# Altium project coreboardV0.1.PrjPCB
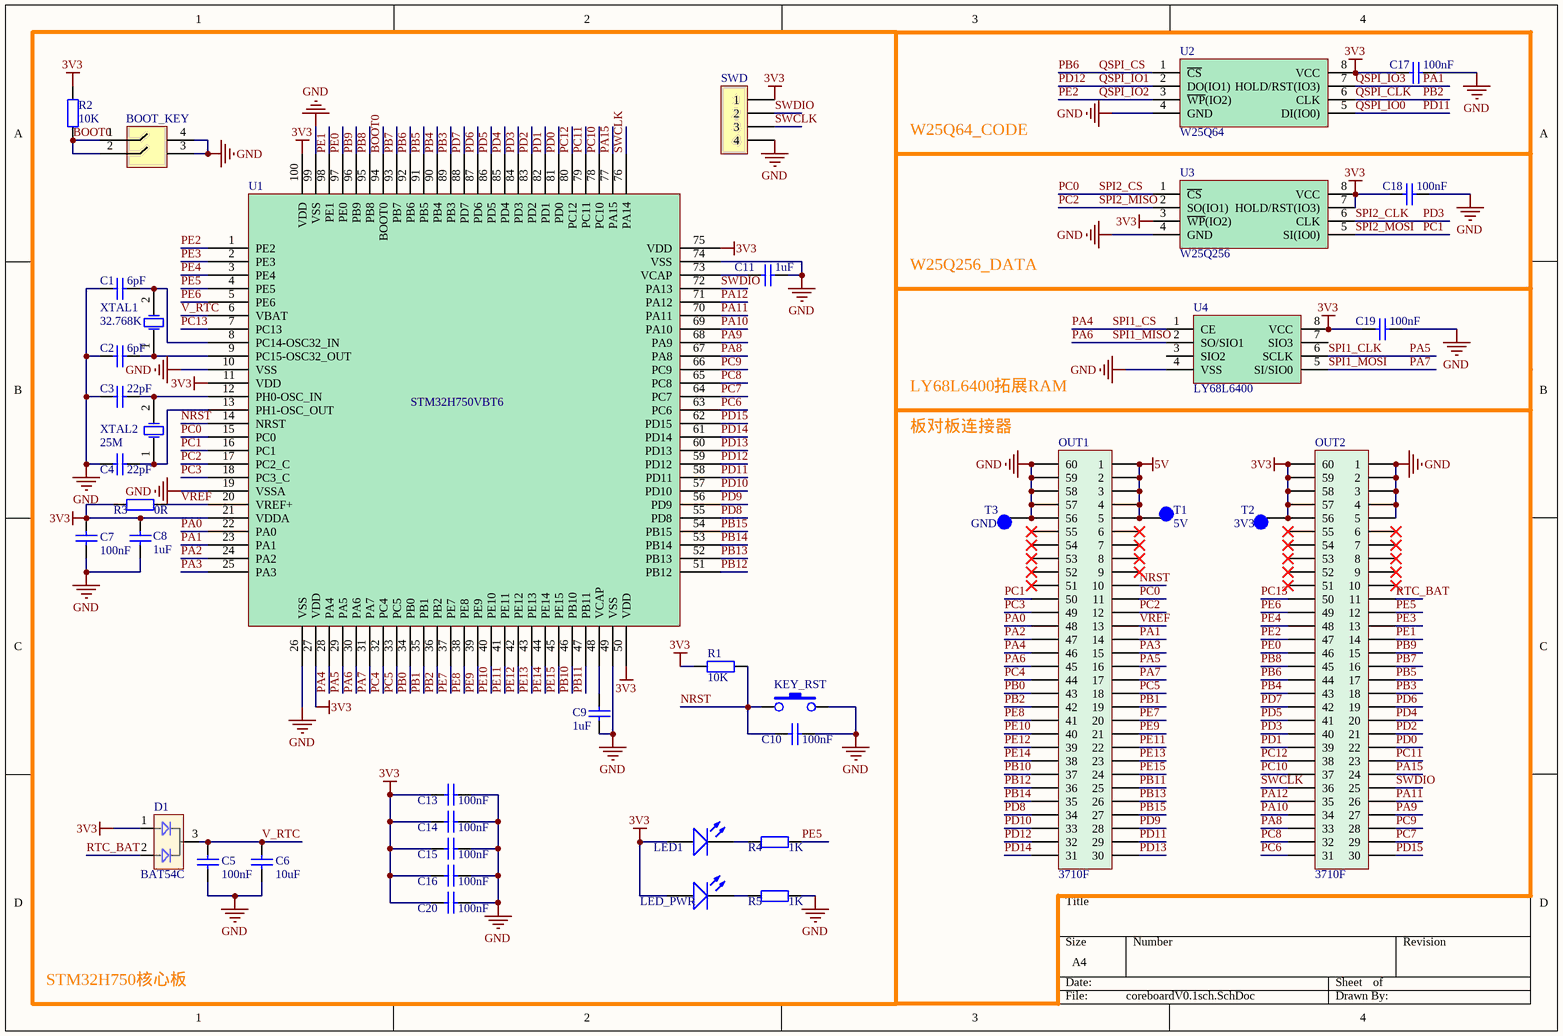
[diagram p0: coreboardV0.1sch.SchDoc]
1 sheet, 41 parts. Net scope: global (net labels, ports and power ports of the same name join across sheets).
Board file: coreboardV0.1pcb.PcbDoc

## Sheet coreboardV0.1sch.SchDoc
size A4

### Parts
BOOT_KEY  KE_2  [KE_2_1.27]  (value not drawn)
C1  6pF  [0603_C]
C2  6pF  [0603_C]
C3  22pF  [0603_C]
C4  22pF  [0603_C]
C5  100nF  [0603_C]
C6  10uF  [0603_C]
C7  100nF  [0603_C]
C8  1uF  [0603_C]
C9  1uF  [0603_C]
C10  100nF  [0603_C]
C11  1uF  [0603_C]
C13  100nF  [0603_C]
C14  100nF  [0603_C]
C15  100nF  [0603_C]
C16  100nF  [0603_C]
C17  100nF  [0603_C]
C18  100nF  [0603_C]
C19  100nF  [0603_C]
C20  100nF  [0603_C]
D1  BAT54C  [BAT54C]
KEY_RST  KEY_SMT  [KEY_SMT]  (value not drawn)
LED1  0805_LED  [0805_LED]  (value not drawn)
LED_PWR  0805_LED  [0805_LED]  (value not drawn)
OUT1  3710F  [3710F060046G3FT01]
OUT2  3710F  [3710F060046G3FT01]
R1  10K  [0603_R]
R2  10K  [0603_R]
R3  0R  [0603_R]
R4  1K  [0603_R]
R5  1K  [0603_R]
SWD  Header_2.54_4P  [HDR1_4P]  (value not drawn)
T1  5V  [TEST_POINT_2mm]
T2  3V3  [TEST_POINT_2mm]
T3  GND  [TEST_POINT_2mm]
U1  STM32H750VBT6  [LQFP100]  (value not drawn)
U2  W25Q64  [SOIC8-208MIL]
U3  W25Q256  [WSON8]
U4  LY68L6400  [SOP8-150MIL]
XTAL1  32.768K  [XTAL_32.768_3215_2]
XTAL2  25M  [XTAL_5032_2]

### Blocks framed on the sheet
STM32H750核心板: BOOT_KEY C1-C11 C13-C16 C20 D1 KEY_RST LED1 LED_PWR R1-R5 SWD U1 XTAL1 XTAL2

### Nets
3V3: C7.2 C8.1 C13.2 C14.2 C15.2 C16.2 C17.1 C18.1 C19.1 C20.2 D1.1 LED1.A LED_PWR.A OUT2.56 OUT2.57 OUT2.58 OUT2.59 OUT2.60 R1.2 R2.1 R3.1 SWD.1 T2.1 U1.11(VDD) U1.21(VDDA) U1.27(VDD) U1.50(VDD) U1.75(VDD) U1.100(VDD) U2.8(VCC) U3.3(~{WP}(IO2)) U3.7(HOLD/RST(IO3)) U3.8(VCC) U4.8(VCC)
5V: OUT1.1 OUT1.2 OUT1.3 OUT1.4 OUT1.5 T1.1
GND: BOOT_KEY.3 BOOT_KEY.4 C1.1 C2.1 C3.1 C4.1 C5.1 C6.1 C7.1 C8.2 C9.2 C10.1 C11.2 C13.1 C14.1 C15.1 C16.1 C17.2 C18.2 C19.2 C20.1 KEY_RST.2 OUT1.56 OUT1.57 OUT1.58 OUT1.59 OUT1.60 OUT2.1 OUT2.2 OUT2.3 OUT2.4 OUT2.5 R5.2 SWD.4 T3.1 U1.10(VSS) U1.19(VSSA) U1.26(VSS) U1.49(VSS) U1.74(VSS) U1.99(VSS) U2.4(GND) U3.4(GND) U4.4(VSS)
BOOT0: BOOT_KEY.1 BOOT_KEY.2 R2.2 U1.94(BOOT0)
NRST: C10.2 KEY_RST.1 OUT1.10 R1.1 U1.14(NRST)
PA0: OUT1.48 U1.22(PA0)
PA1: OUT1.14 U1.23(PA1) U2.7(HOLD/RST(IO3))  [also labelled QSPI_IO3]
PA2: OUT1.47 U1.24(PA2)
PA3: OUT1.15 U1.25(PA3)
PA4: OUT1.46 U1.28(PA4) U4.1(CE)  [also labelled SPI1_CS]
PA5: OUT1.16 U1.29(PA5) U4.6(SCLK)  [also labelled SPI1_CLK]
PA6: OUT1.45 U1.30(PA6) U4.2(SO/SIO1)  [also labelled SPI1_MISO]
PA7: OUT1.17 U1.31(PA7) U4.5(SI/SIO0)  [also labelled SPI1_MOSI]
PA8: OUT2.33 U1.67(PA8)
PA9: OUT2.27 U1.68(PA9)
PA10: OUT2.34 U1.69(PA10)
PA11: OUT2.26 U1.70(PA11)
PA12: OUT2.35 U1.71(PA12)
PA15: OUT2.24 U1.77(PA15)
PB0: OUT1.43 U1.34(PB0)
PB1: OUT1.19 U1.35(PB1)
PB2: OUT1.42 U1.36(PB2) U2.6(CLK)  [also labelled QSPI_CLK]
PB3: OUT2.18 U1.89(PB3)
PB4: OUT2.43 U1.90(PB4)
PB5: OUT2.17 U1.91(PB5)
PB6: OUT2.44 U1.92(PB6) U2.1(~{CS})  [also labelled QSPI_CS]
PB7: OUT2.16 U1.93(PB7)
PB8: OUT2.45 U1.95(PB8)
PB9: OUT2.15 U1.96(PB9)
PB10: OUT1.37 U1.46(PB10)
PB11: OUT1.25 U1.47(PB11)
PB12: OUT1.36 U1.51(PB12)
PB13: OUT1.26 U1.52(PB13)
PB14: OUT1.35 U1.53(PB14)
PB15: OUT1.27 U1.54(PB15)
PC0: OUT1.11 U1.15(PC0) U3.1(~{CS})  [also labelled SPI2_CS]
PC1: OUT1.50 U1.16(PC1) U3.5(SI(IO0))  [also labelled SPI2_MOSI]
PC2: OUT1.12 U1.17(PC2_C) U3.2(SO(IO1))  [also labelled SPI2_MISO]
PC3: OUT1.49 U1.18(PC3_C)
PC4: OUT1.44 U1.32(PC4)
PC5: OUT1.18 U1.33(PC5)
PC6: OUT2.31 U1.63(PC6)
PC7: OUT2.29 U1.64(PC7)
PC8: OUT2.32 U1.65(PC8)
PC9: OUT2.28 U1.66(PC9)
PC10: OUT2.37 U1.78(PC10)
PC11: OUT2.23 U1.79(PC11)
PC12: OUT2.38 U1.80(PC12)
PC13: OUT2.50 U1.7(PC13)
PD0: OUT2.22 U1.81(PD0)
PD1: OUT2.39 U1.82(PD1)
PD2: OUT2.21 U1.83(PD2)
PD3: OUT2.40 U1.84(PD3) U3.6(CLK)  [also labelled SPI2_CLK]
PD4: OUT2.20 U1.85(PD4)
PD5: OUT2.41 U1.86(PD5)
PD6: OUT2.19 U1.87(PD6)
PD7: OUT2.42 U1.88(PD7)
PD8: OUT1.34 U1.55(PD8)
PD9: OUT1.28 U1.56(PD9)
PD10: OUT1.33 U1.57(PD10)
PD11: OUT1.29 U1.58(PD11) U2.5(DI(IO0))  [also labelled QSPI_IO0]
PD12: OUT1.32 U1.59(PD12) U2.2(DO(IO1))  [also labelled QSPI_IO1]
PD13: OUT1.30 U1.60(PD13)
PD14: OUT1.31 U1.61(PD14)
PD15: OUT2.30 U1.62(PD15)
PE0: OUT2.46 U1.97(PE0)
PE1: OUT2.14 U1.98(PE1)
PE2: OUT2.47 U1.1(PE2) U2.3(~{WP}(IO2))  [also labelled QSPI_IO2]
PE3: OUT2.13 U1.2(PE3)
PE4: OUT2.48 U1.3(PE4)
PE5: OUT2.12 R4.2 U1.4(PE5)
PE6: OUT2.49 U1.5(PE6)
PE7: OUT1.20 U1.37(PE7)
PE8: OUT1.41 U1.38(PE8)
PE9: OUT1.21 U1.39(PE9)
PE10: OUT1.40 U1.40(PE10)
PE11: OUT1.22 U1.41(PE11)
PE12: OUT1.39 U1.42(PE12)
PE13: OUT1.23 U1.43(PE13)
PE14: OUT1.38 U1.44(PE14)
PE15: OUT1.24 U1.45(PE15)
RTC_BAT: D1.2 OUT2.11
SWCLK: OUT2.36 SWD.3 U1.76(PA14)
SWDIO: OUT2.25 SWD.2 U1.72(PA13)
V_RTC: C5.2 C6.2 D1.3 U1.6(VBAT)
VREF: OUT1.13 R3.2 U1.20(VREF+)
NetC1_2: C1.2 U1.8(PC14-OSC32_IN) XTAL1.2(OSC2)
NetC2_2: C2.2 U1.9(PC15-OSC32_OUT) XTAL1.1(OSC1)
NetC3_2: C3.2 U1.12(PH0-OSC_IN) XTAL2.2(OSC2)
NetC4_2: C4.2 U1.13(PH1-OSC_OUT) XTAL2.1(OSC1)
NetC9_1: C9.1 U1.48(VCAP)
NetC11_1: C11.1 U1.73(VCAP)
NetLED1_K: LED1.K R4.1
NetLED_PWR_K: LED_PWR.K R5.1

Not connected (* = marked no-connect by the designer): OUT1 6* 7* 8* 9* 51* 52* 53* 54* 55*; OUT2 6* 7* 8* 9* 10* 51* 52* 53* 54* 55*; U4 3(SIO2) 7(SIO3)

### Notes on the sheet
- W25Q64_CODE
- W25Q256_DATA
- LY68L6400拓展RAM
- 板对板连接器

### Library data of the parts
BOOT_KEY = KE_2_1.27
C1-C11 C13-C20 = 0603_CAP
OUT1 OUT2 = 3710F_30*2pin
R1-R5 = 0603_RES
T1-T3 = TEST_POINT_2mm
XTAL1 = XTAL_32.768_3215_2
XTAL2 = XTAL_8MHz_5032_2